# Altium schematic sheet FilterControl.Schematic.SchDoc
size A3
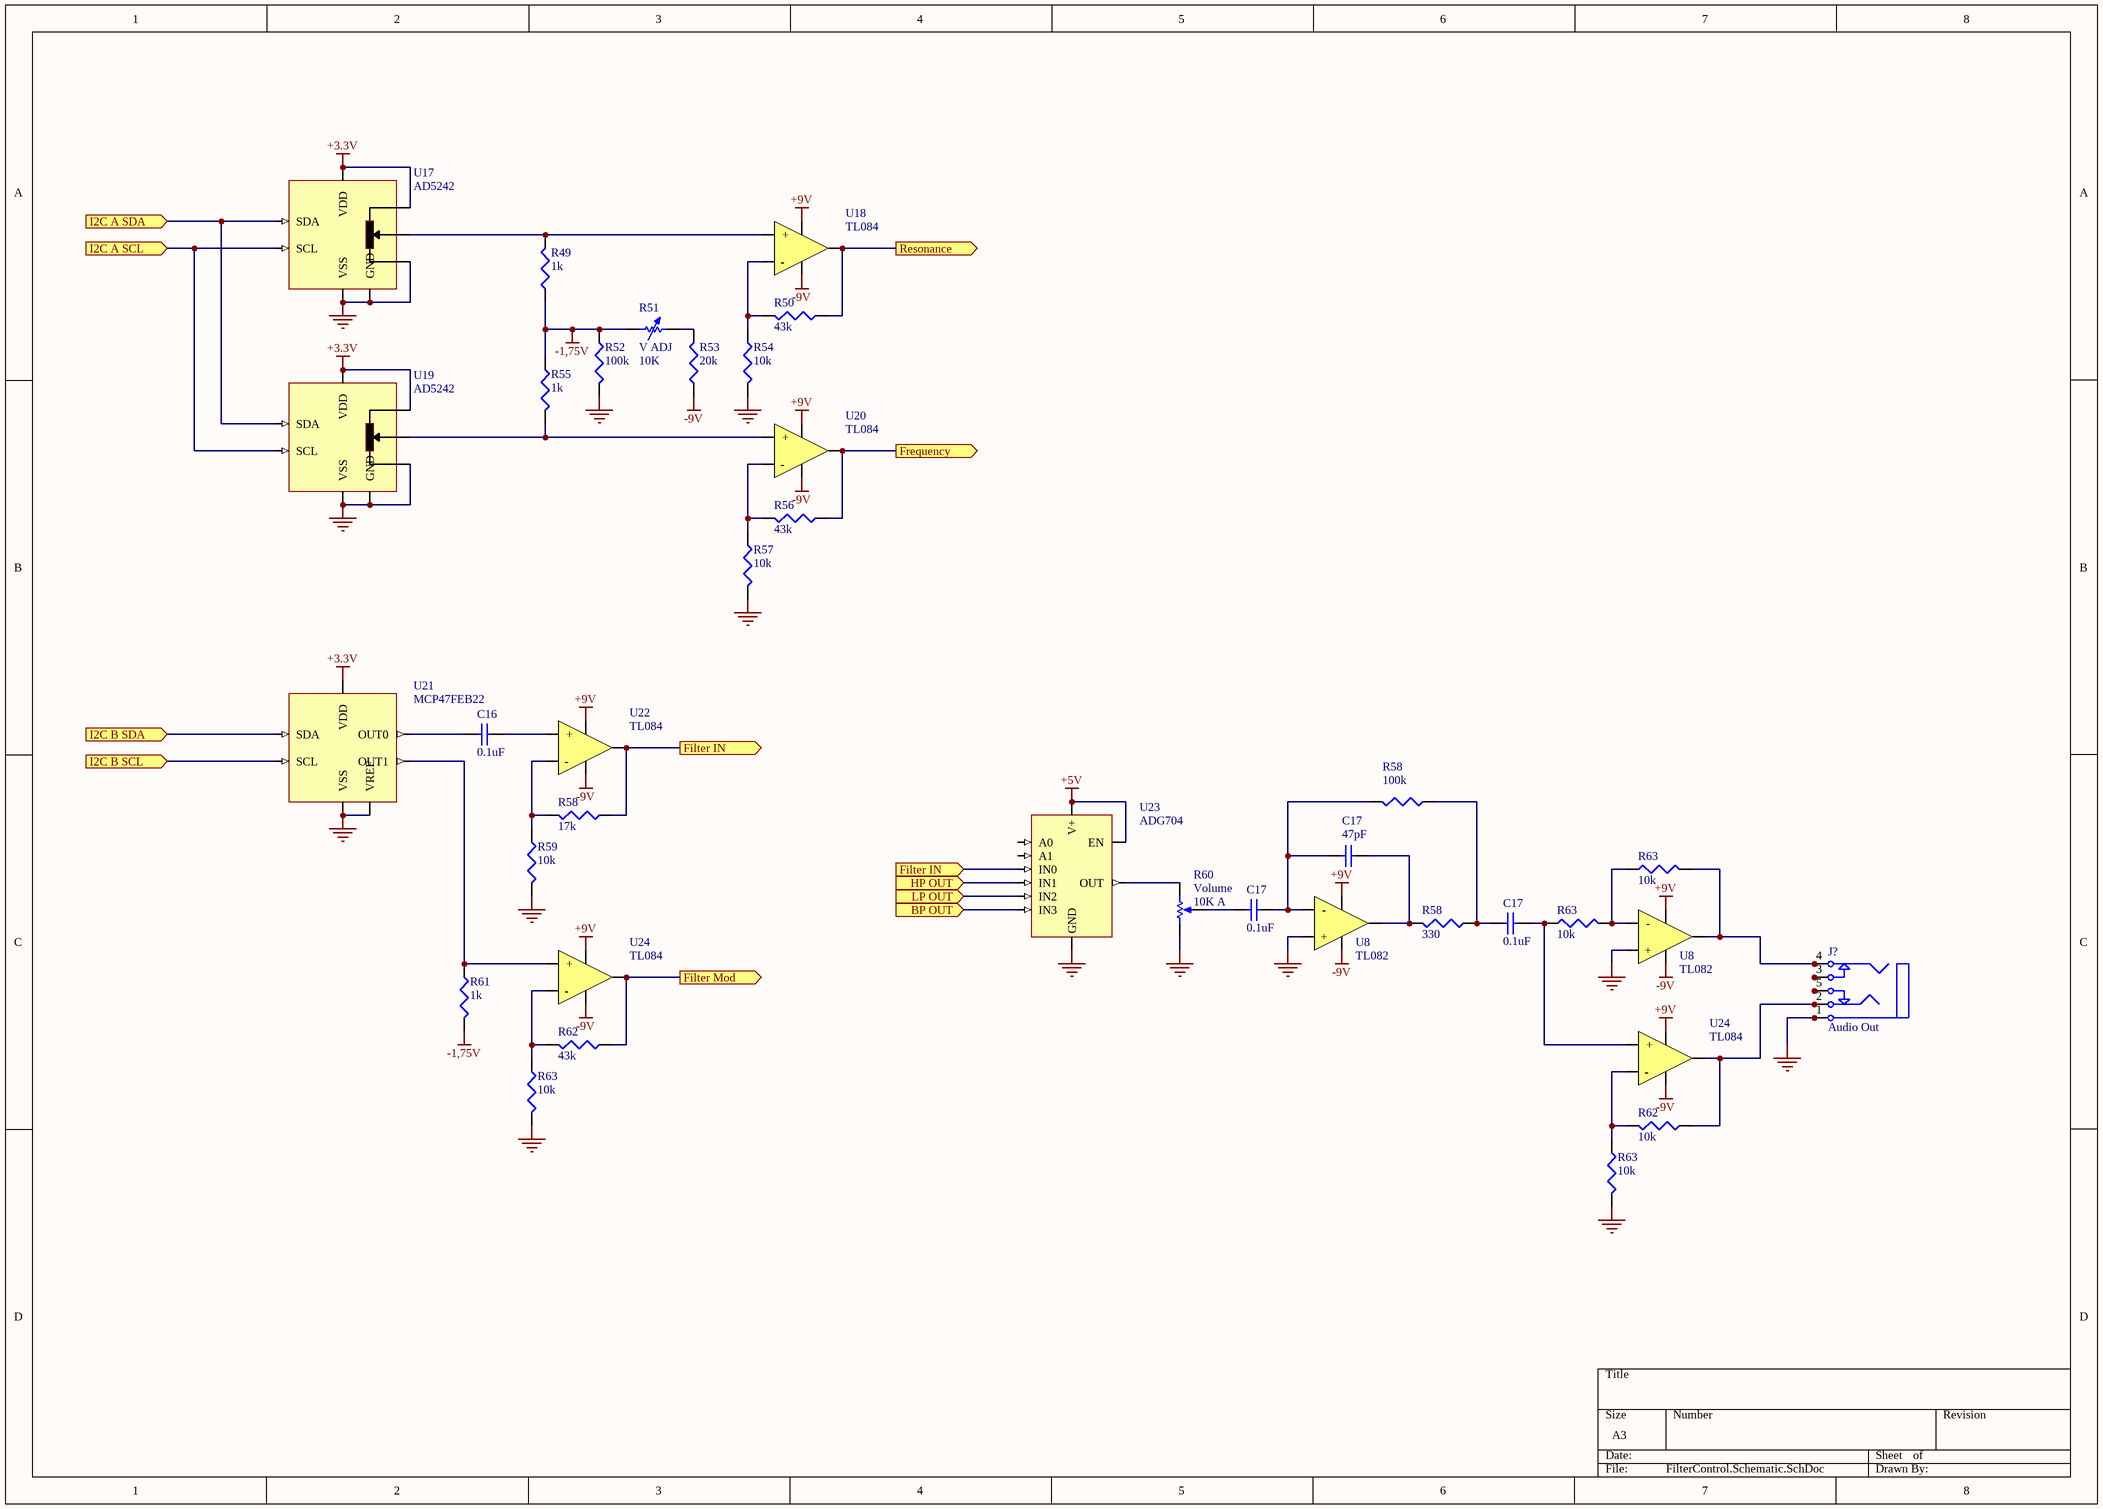
[diagram p0: FilterControl.Schematic.SchDoc]

## Parts
(Parts that share a designator on the sheet are numbered #1, #2 ... from top to bottom, then left to right.)
C16  0.1uF  [C1206]
C17#1  47pF  [C1206]
C17#2  0.1uF  [C1206]
C17#3  0.1uF  [C1206]
J?  Audio Out  [ST-3150-5N]
R49  1k  [J1-0603]
R50  43k  [J1-0603]
R51  V ADJ  value 10K  [AXIAL-0.7]
R52  100k  [J1-0603]
R53  20k  [J1-0603]
R54  10k  [J1-0603]
R55  1k  [J1-0603]
R56  43k  [J1-0603]
R57  10k  [J1-0603]
R58#1  100k  [J1-0603]
R58#2  17k  [J1-0603]
R58#3  330  [J1-0603]
R59  10k  [J1-0603]
R60  Volume  value 10K A  [VR5]
R61  1k  [J1-0603]
R62#1  43k  [J1-0603]
R62#2  10k  [J1-0603]
R63#1  10k  [J1-0603]
R63#2  10k  [J1-0603]
R63#3  10k  [J1-0603]
R63#4  10k  [J1-0603]
U8#1  TL082
U8#2  TL082
U17  AD5242
U18  TL084
U19  AD5242
U20  TL084
U21  MCP47FEB22
U22  TL084
U23  ADG704
U24#1  TL084
U24#2  TL084

## Ports
BP OUT (in), Filter IN (in), Filter IN (out), Filter Mod (out), Frequency (out), HP OUT (in), I2C A SCL (in), I2C A SDA (in), I2C B SCL (in), I2C B SDA (in), LP OUT (in), Resonance (out)

## Nets
+3.3V: U17.1(A) U17.4(VDD) U19.1(A) U19.4(VDD) U21.1(VDD)
+5V: U23.5(EN) U23.6(V+)
+9V: U8#1.8(VCC+) U8#2.8(VCC+) U18.4(VCC+) U20.4(VCC+) U22.4(VCC+) U24#1.4(VCC+) U24#2.4(VCC+)
-1,75V: R49.1 R51.1 R52.1 R55.1 R61.2
-9V: R53.2 U8#1.4(VCC-) U8#2.4(VCC-) U18.11(VCC-) U20.11(VCC-) U22.11(VCC-) U24#1.11(VCC-) U24#2.11(VCC-)
GND: J?.1 J?.1A J?.1B R52.2 R54.2 R57.2 R59.2 R60.1(TOP) R63#3.2 R63#4.2 U8#1.3(+) U8#2.3(+) U17.3(B) U17.10(GND) U17.11(VSS) U19.3(B) U19.10(GND) U19.11(VSS) U21.2(VREF) U21.5(VSS) U23.3(GND)
BP OUT: U23.7(IN3) ; port BP OUT
Filter IN: R58#2.1 U22.1(OUT) U23.2(IN0) ; port Filter IN
Filter Mod: R62#1.1 U24#1.1(OUT) ; port Filter Mod
Frequency: R56.1 U20.1(OUT) ; port Frequency
HP OUT: U23.9(IN1) ; port HP OUT
I2C A SCL: U17.7(SCL) U19.7(SCL) ; port I2C A SCL
I2C A SDA: U17.6(SDA) U19.6(SDA) ; port I2C A SDA
I2C B SCL: U21.7(SCL) ; port I2C B SCL
I2C B SDA: U21.8(SDA) ; port I2C B SDA
LP OUT: U23.4(IN2) ; port LP OUT
Resonance: R50.1 U18.1(OUT) ; port Resonance
NetC16_1: C16.1 U21.3(OUT0)
NetC16_2: C16.2 U22.2(+)
NetC17#1_1: C17#1.1 C17#2.2 R58#1.2 U8#1.2(-)
NetC17#1_2: C17#1.2 R58#3.2 U8#1.1(OUT)
NetC17#2_1: C17#2.1 R60.3(TAP)
NetC17#3_1: C17#3.1 R58#1.1 R58#3.1
NetC17#3_2: C17#3.2 R63#2.1 U24#2.2(+)
NetJ?_2: J?.2 J?.2A J?.2B R62#2.1 U24#2.1(OUT)
NetJ?_3: J?.3 J?.3A J?.3B
NetJ?_4: J?.4 J?.4A J?.4B R63#1.2 U8#2.1(OUT)
NetJ?_5: J?.5 J?.5A J?.5B
NetR49_2: R49.2 U17.2(W) U18.2(+)
NetR50_2: R50.2 R54.1 U18.3(-)
NetR51_2: R51.2 R53.1
NetR55_2: R55.2 U19.2(W) U20.2(+)
NetR56_2: R56.2 R57.1 U20.3(-)
NetR58#2_2: R58#2.2 R59.1 U22.3(-)
NetR60_2: R60.2(BOT) U23.8(OUT)
NetR61_1: R61.1 U21.4(OUT1) U24#1.2(+)
NetR62#1_2: R62#1.2 R63#3.1 U24#1.3(-)
NetR62#2_2: R62#2.2 R63#4.1 U24#2.3(-)
NetR63#1_1: R63#1.1 R63#2.2 U8#2.2(-)

Not connected (* = marked no-connect by the designer): U23 1(A0) 10(A1)

## Library data of the parts
C16 C17#2 C17#3 = Cap Semi: Capacitor (Semiconductor SIM Model); Value: 0.1u; Published: 8-Jun-2000; LatestRevisionDate: 29-May-2009; LatestRevisionNote: IPC-7351 Footprint Added.; PackageReference: C1206; Publisher: Altium Limited; PackageDescription: Chip Capacitor
C17#1 = Cap Semi: Capacitor (Semiconductor SIM Model); Published: 8-Jun-2000; LatestRevisionDate: 29-May-2009; LatestRevisionNote: IPC-7351 Footprint Added.; PackageReference: C1206; Publisher: Altium Limited; PackageDescription: Chip Capacitor; Value: 47pF
J? = Phonejack Stereo SW: 3-Conductor Jack with 2 break contacts (normals) and 2 auxiliary make contacts; Published: 5-Jan-2004; LatestRevisionDate: 17-Dec-2003; LatestRevisionNote: PCB Footprint replaced.; DatasheetDocument: 07-Mar-2000; Publisher: Altium Limited; ComponentLink1Description: Manufacturer Link; ComponentLink1URL: http://domino.kycon.com/internet/Products.html
R49 R50 R52-R57 R58#1-R58#3 R59 R61 R62#1 R62#2 R63#1-R63#4 = Res3: Resistor; Published: 8-Jun-2000; LatestRevisionDate: 29-May-2009; LatestRevisionNote: IPC-7351 Footprint Added.; PackageReference: J1-0603; Publisher: Altium Limited; PackageDescription: Chip Resistor
  R49 R55 R61: Value: 1K
  R50 R56 R62#1: Value: 43K
  R52 R58#1: Value: 100K
  R53: Value: 20K
  R54 R57 R59 R62#2 R63#1-R63#4: Value: 10K
  R58#2: Value: 17K
  R58#3: Value: 330
R51 = Res Adj1: Variable Resistor; Set Position: 0.5; Published: 8-Jun-2000; LatestRevisionDate: 17-Jul-2002; LatestRevisionNote: Re-released for DXP Platform.; PackageReference: AXIAL-0.7; Publisher: Altium Limited; PackageDescription: Axial Device, Thru-Hole; 2 Leads; 0.7 in Pin Spacing
R60 = RPot: Potentiometer; Sim Note: Enter the Resistance value and the set point into parameter fields.; Set Position: 0.5; Published: 8-Jun-2000; LatestRevisionDate: 17-Jul-2002; LatestRevisionNote: Re-released for DXP Platform.; PackageReference: VR5; Publisher: Altium Limited; PackageDescription: Variable Resistor, Thru-Hole; 3 Leads